# EAGLE design Xtend-devboard (EAGLE 5.11)
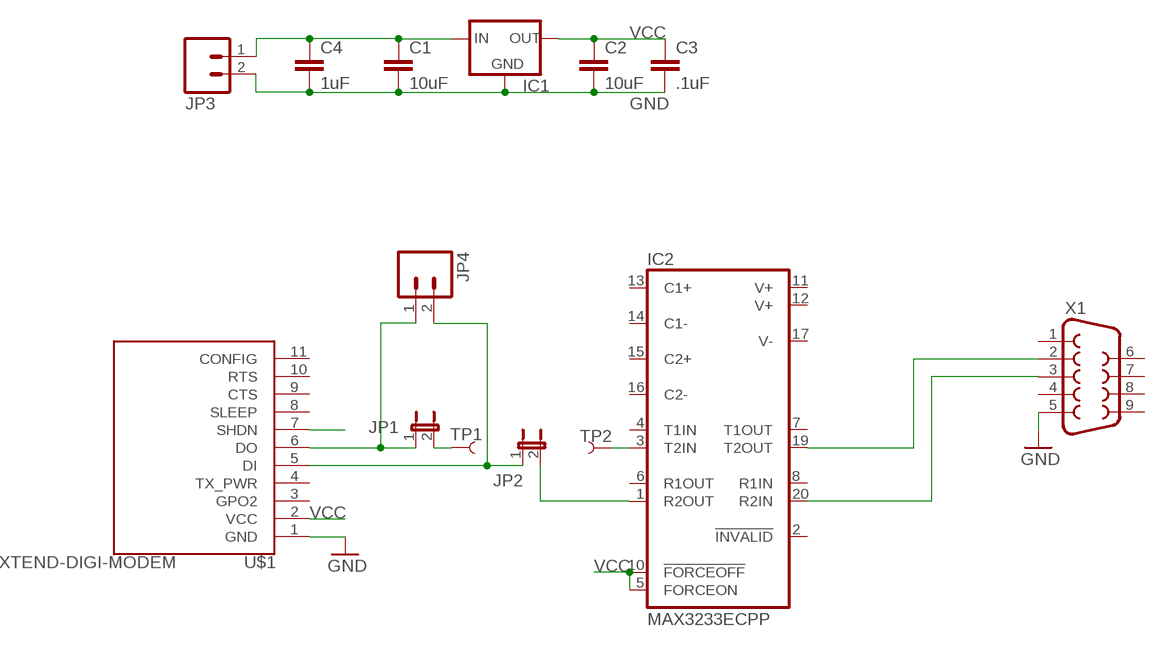
[diagram p0: schematic, sheet 1]

## Parts
C1  10uF  CAPPTH  [CAP-PTH-SMALL]
C2  10uF  CAPPTH  [CAP-PTH-SMALL]
C3  .1uF  CAPPTH  [CAP-PTH-SMALL]
C4  1uF  CAPPTH  [CAP-PTH-SMALL]
IC1  V_REG_78XXSINK  [TO220-IGO]
IC2  MAX3233ECPP  [DIL20]
JP1  JUMPER-2PTH  [1X02]
JP2  JUMPER-2PTH  [1X02]
JP3  M025MM  [SCREWTERMINAL-5MM-2]
JP4  M025MM  [SCREWTERMINAL-5MM-2]
TP1  TEST-POINT5X5-TH  [PAD.10X.10-TH]
TP2  TEST-POINT5X5-TH  [PAD.10X.10-TH]
U$1  XTEND-DIGI-MODEM  [XTEND-DIGI-MODEM]
X1  DB9FEMALE  [DB9]

## Nets
GND: C1.2 C2.2 C3.2 C4.2 IC1.GND JP3.2 U$1.1(GND) X1.5
N$1: IC2.19(T2OUT) X1.2
N$2: IC2.20(R2IN) X1.3
N$4: C1.1 C4.1 IC1.IN JP3.1
N$5: IC2.1(R2OUT) JP2.2
N$6: JP2.1 JP4.2 U$1.5(DI)
N$7: JP1.1 JP4.1 U$1.6(DO)
N$9: JP1.2 TP1.P$1
N$10: IC2.3(T2IN) TP2.P$1
VCC: C2.1 C3.1 IC1.OUT IC2.5(FORCEON) IC2.10(!FORCEOFF) U$1.2(VCC) U$1.7(SHDN)
Unconnected: IC2.2(!INVALID) IC2.4(T1IN) IC2.6(R1OUT) IC2.7(T1OUT) IC2.8(R1IN) IC2.11(V+) IC2.12(V+) IC2.13(C1+) IC2.14(C1-) IC2.15(C2+) IC2.16(C2-) IC2.17(V-) U$1.3(GPO2) U$1.4(TX_PWR) U$1.8(SLEEP) U$1.9(CTS) U$1.10(RTS) U$1.11(CONFIG) X1.1 X1.4 X1.6 X1.7 X1.8 X1.9

## Power pins joined to a net without a drawn wire
GND: IC2.18(GND)
VCC: IC2.9(VCC)

## Library data of the parts
C1-C4 = SparkFun:CAP: Capacitor Standard 0603 ceramic capacitor, and 0.1" leaded capacitor.
IC1 = SparkFun:V_REG_78XX: Voltage Regulator Standard 7805 5V regulator. IGO (Input Ground Output). Spark Fun Electronics SKU : COM-00107
IC2 = maxim:MAX3233E: Dual RS-232 Transceivers with Internal Capacitors ±15kV ESD-Protected, 1µA, 250kbps, 3.3V/5V Source: http://datasheets.maxim-ic.com/en/ds/MAX3233E-MAX3235E.pdf; MPN: MAX3233ECPP+G36; OC_FARNELL: unknown; OC_NEWARK: 89K3596
JP1 JP2 = SparkFun:JUMPER-2: Jumper Basic 0.1" spaced jumper. Use with breakaway headers.
JP3 JP4 = SparkFun:M02: Header 2 Standard 2-pin 0.1" header. Use with straight break away headers (SKU : PRT-00116), right angle break away headers (PRT-00553), swiss pins (PRT-00743), machine pins (PRT-00117), and female headers (PRT-00115). Molex polarized connector foot print use with SKU : PRT-08233 with associated crimp pins and housings.
TP1 TP2 = ASL:TEST-POINT
U$1 = ASL:XTEND-DIGI-MODEM: Xtend Digi Modem WRL-09411
X1 = SparkFun:DB9: DB9 Connector Standard DB9 (D-Sub 9) serial connector. Can be used for CAN bus as well as RS485 and RS232. Footprint production proven. Spark Fun Electronics SKU : PRT-00429

## Board
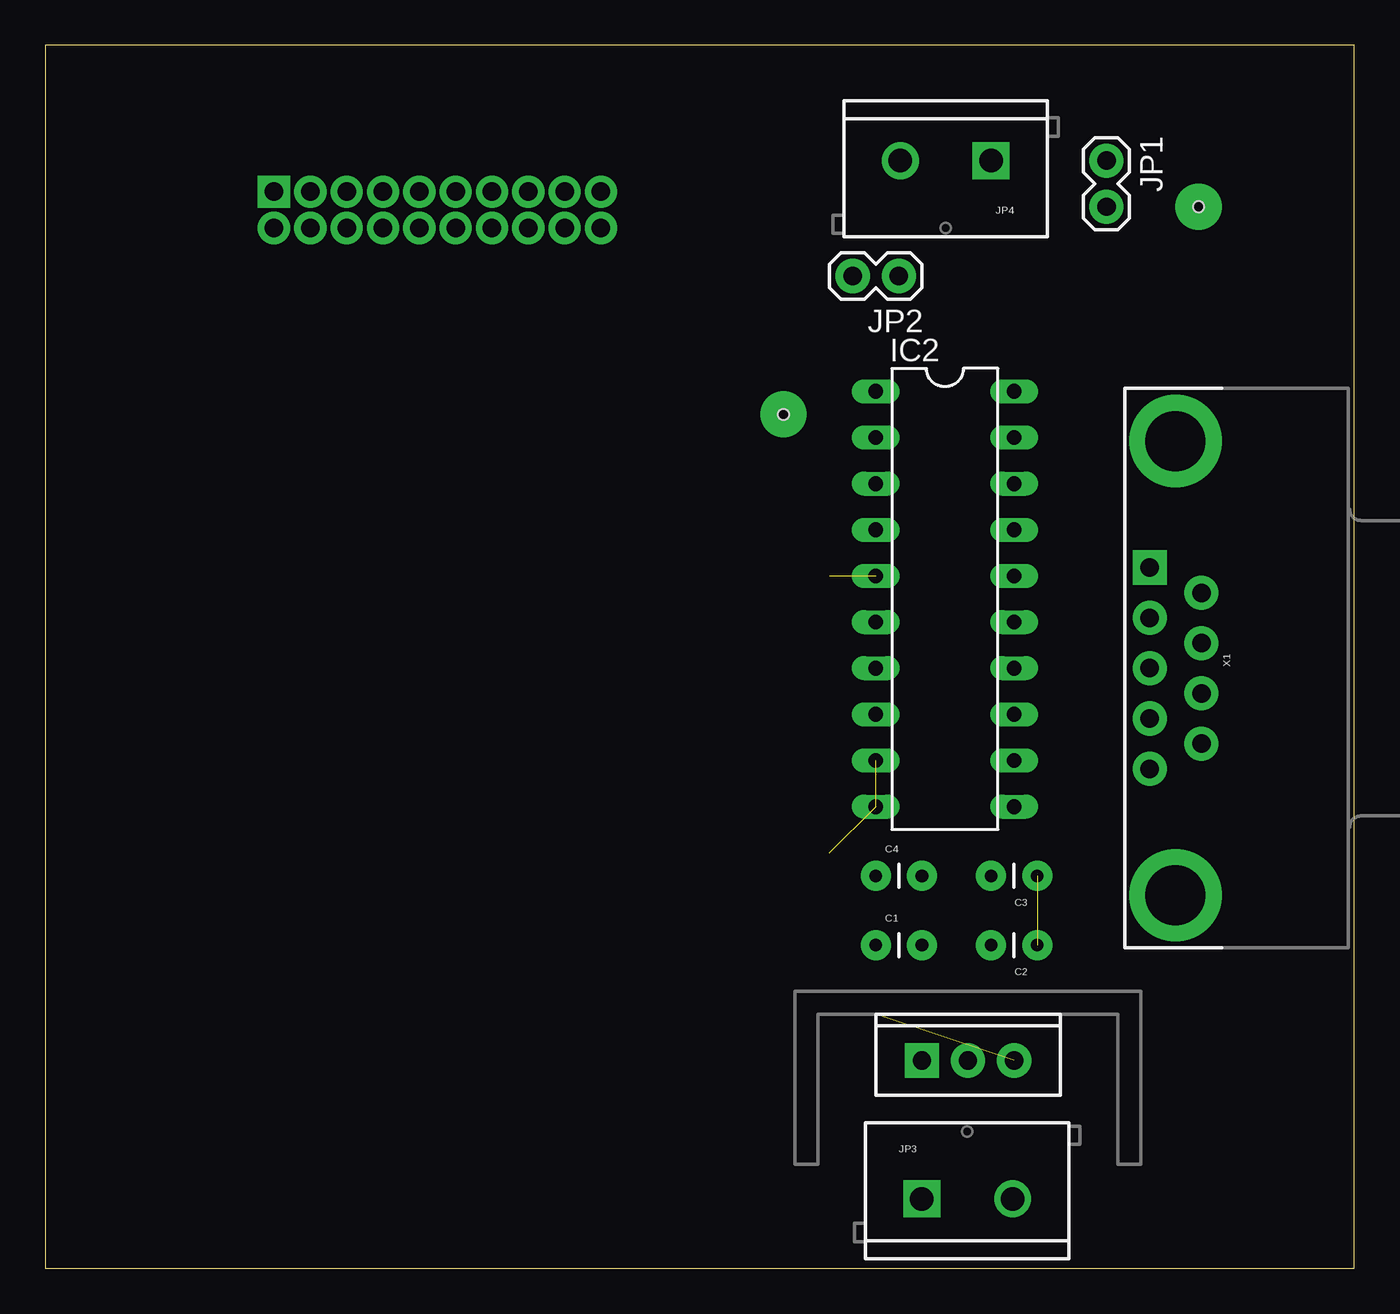
[diagram p1: board, top side]
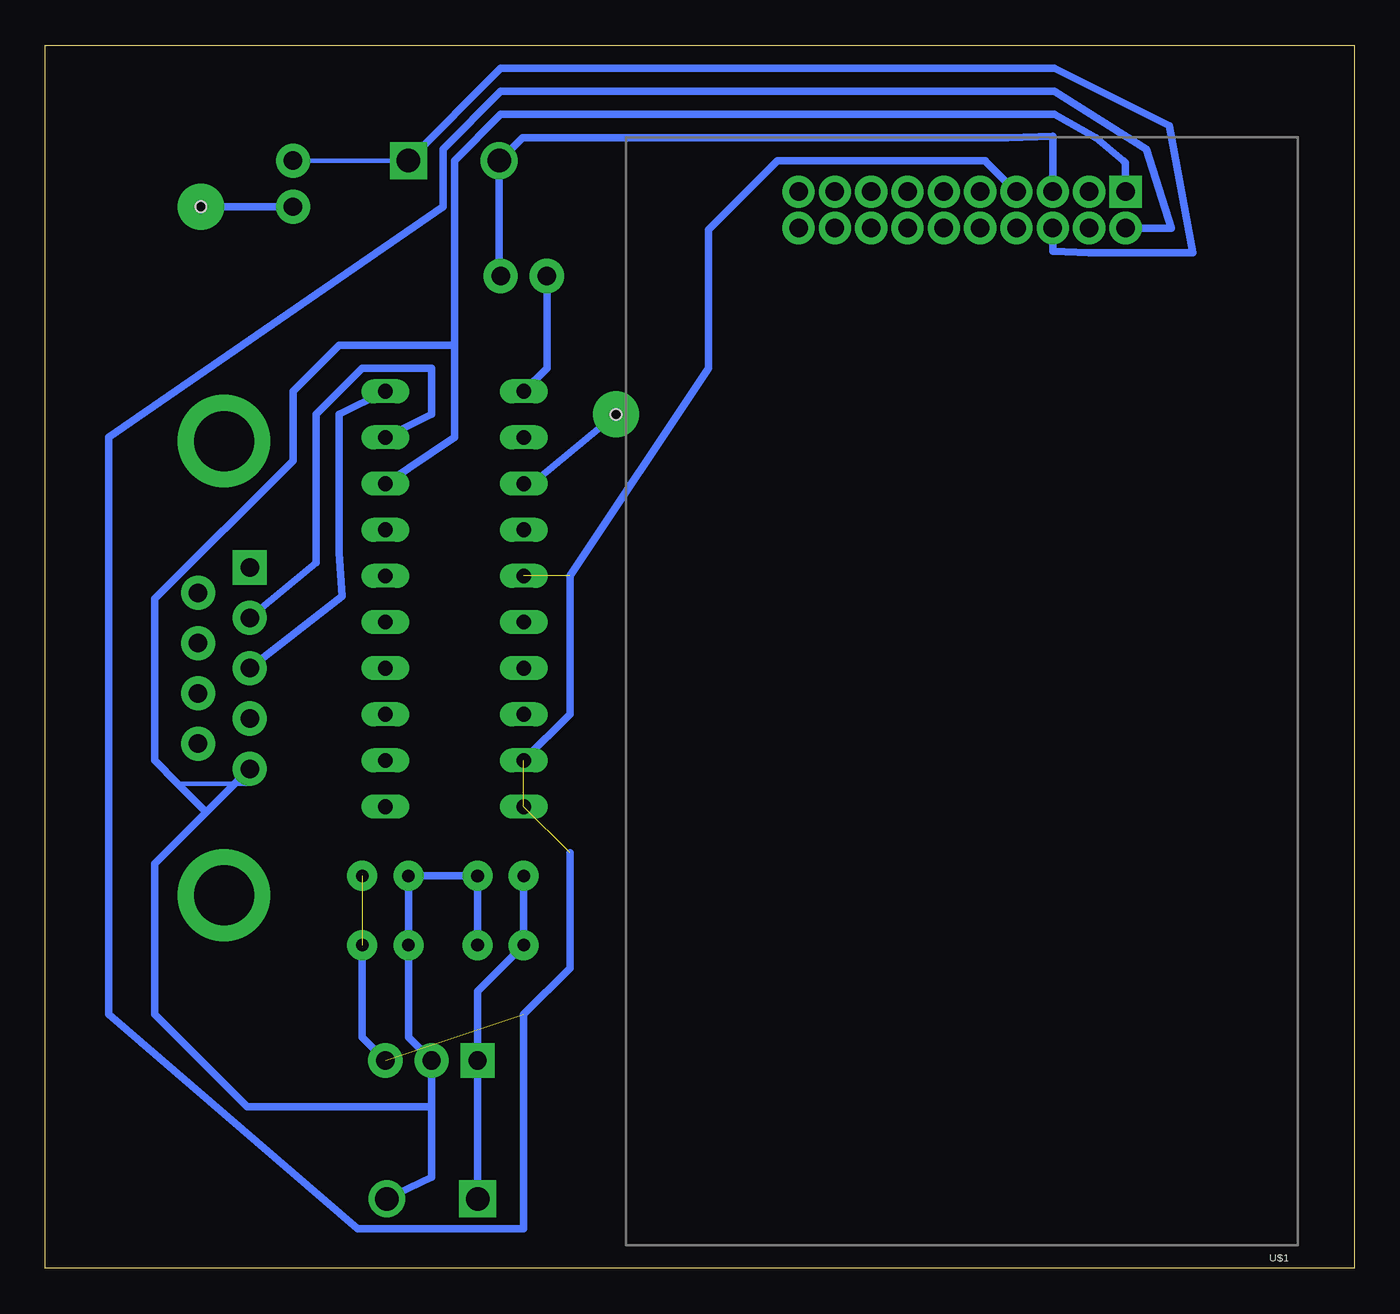
[diagram p2: board, bottom side, seen from below]

Size 72.06 x 67.3 mm. Coordinates in mm from the lower left corner, seen from the top.
Outline: 0,0 72.06,0 72.06,67.3 0,67.3 0,0
Copper layers (1*16): Top 0.035mm / dielectric 1.5mm / Bottom 0.035mm
Design rules "default": minimum track width 10mil, minimum drill 24mil, track to track 8mil, track to pad 8mil, pad to pad 8mil, via to via 8mil, smd to smd 8mil, copper to edge 40mil, drill to drill 8mil, minimum pad ring 10mil, minimum via ring 8mil, stop-mask expansion 4mil, vias tented up to drill 0mil, thermal gap 10mil

### Footprints (pad centres in the part's own frame; a part is rotated, then mirrored left to right if it is on the bottom)
CAP-PTH-SMALL = drill 0.7 pad 1.651 round: 1 0,0; 2 2.54,0
TO220-IGO = drill 1 pad 1.88 round: GND 0,0; OUT 2.54,0 | drill 1 pad 1.88 square: IN -2.54,0
DIL20 = drill 0.813 long: 1 -11.43,-3.81; 2 -8.89,-3.81; 3 -6.35,-3.81; 4 -3.81,-3.81; 5 -1.27,-3.81; 6 1.27,-3.81; 7 3.81,-3.81; 8 6.35,-3.81; 9 8.89,-3.81; 10 11.43,-3.81; 11 11.43,3.81; 12 8.89,3.81; 13 6.35,3.81; 14 3.81,3.81; 15 1.27,3.81; 16 -1.27,3.81; 17 -3.81,3.81; 18 -6.35,3.81; 19 -8.89,3.81; 20 -11.43,3.81
1X02 = drill 1.016 pad 1.88 round: 1 0,0; 2 2.54,0
SCREWTERMINAL-5MM-2 = drill 1.3 pad 2.032 square: 1 0,0 | drill 1.3 pad 2.032 round: 2 5,0
PAD.10X.10-TH = drill 0.6 pad 2.54 round: P$1 0,0 | hole 0.6: 0,0
XTEND-DIGI-MODEM = drill 1.016 pad 1.778 square: 1 -9,-27.5 | drill 1.016 pad 1.778 round: 2 -9,-25.5; 3 -7,-27.5; 4 -7,-25.5; 5 -5,-27.5; 6 -5,-25.5; 7 -3,-27.5; 8 -3,-25.5; 9 -1,-27.5; 10 -1,-25.5; 11 1,-27.5; 12 1,-25.5; 13 3,-27.5; 14 3,-25.5; 15 5,-27.5; 16 5,-25.5; 17 7,-27.5; 18 7,-25.5; 19 9,-27.5; 20 9,-25.5
DB9 = drill 1.016 pad 1.88 square: 1 -5.54,-1.42 | drill 1.016 pad 1.88 round: 2 -2.77,-1.42; 3 0,-1.42; 4 2.77,-1.42; 5 5.54,-1.42; 6 -4.15,1.42; 7 -1.38,1.42; 8 1.38,1.42; 9 4.15,1.42 | drill 3.302 pad 5.08 round: G1 -12.5,0; G2 12.5,0

### Placement (x,y rotation side)
C1  45.72,17.78 0 top
C2  54.61,17.78 180 top
C3  54.61,21.59 180 top
C4  45.72,21.59 0 top
IC1  50.8,11.43 0 top
IC2  49.53,36.83 270 top
JP1  58.42,60.96 270 top
JP2  46.99,54.61 180 top
JP3  48.26,3.81 0 top
JP4  52.07,60.96 180 top
TP1  63.5,58.42 0 top
TP2  40.64,46.99 0 top
U$1  21.59,31.75 180 bottom
X1  62.23,33.02 270 top

### Tracks (layer width: path | path; a pad name or v marks a point on that pad's centre or on a via)
GND
  Bottom 0.254: 64.77,26.67 60.96,26.67 X1.5
  Bottom 0.406: 49.53,50.8 49.53,60.96 46.99,63.5 16.51,63.5 14.22,62.23 12.7,60.96 12.59,60.85 U$1.1 | 49.53,50.8 49.53,45.72 IC2.18 | 63.2,25.09 64.77,26.67 66.04,27.94 66.04,36.83 58.42,44.45 58.42,48.26 55.88,50.8 49.53,50.8 | C1.2 C4.2 C3.2 C2.2 52.07,12.7 IC1.GND 50.8,8.89 | 50.8,8.89 50.8,5 JP3.2 | 50.8,8.89 60.96,8.89 66.04,13.97 66.04,22.25 X1.5
N$1
  Bottom 0.406: IC2.19 50.8,46.99 50.8,49.53 54.61,49.53 57.15,46.99 57.15,38.81 X1.2
N$2
  Bottom 0.406: X1.3 55.73,36.98 55.88,39.37 55.88,46.99 IC2.20
N$4
  Bottom 0.406: JP3.1 IC1.IN 48.26,15.24 C1.1 C4.1
N$5
  Bottom 0.406: JP2.2 44.45,49.53 IC2.1
N$6
  Bottom 0.406: JP2.1 47.07,54.69 JP4.2 45.8,62.23 19.05,62.23 16.59,62.31 U$1.5
N$7
  Bottom 0.254: JP4.1 JP1.1
  Bottom 0.406: U$1.6 16.59,55.96 14.61,55.88 8.89,55.88 10.16,62.86 16.51,66.04 46.99,66.04 JP4.1
N$9
  Bottom 0.406: JP1.2 TP1.P$1
N$10
  Bottom 0.406: IC2.3 44.96,43.43 TP2.P$1
VCC  (5 unrouted)
  Bottom 0.406: IC2.9 43.18,30.48 43.18,38.1 35.56,49.53 35.56,57.15 31.75,60.96 20.32,60.96 | 20.32,60.96 20.3,60.96 | U$1.2 10.06,57.25 11.43,61.59 16.51,64.77 46.99,64.77 50.16,61.59 50.16,58.42 68.58,45.72 68.58,13.97 54.86,2.16 45.72,2.16 45.72,13.97 43.18,16.51 43.18,22.86 | IC1.OUT 54.61,12.7 C2.1 | U$1.7 18.61,59.25 20.32,60.96